# Altium schematic sheet AFE.SchDoc (part 3 of 3)
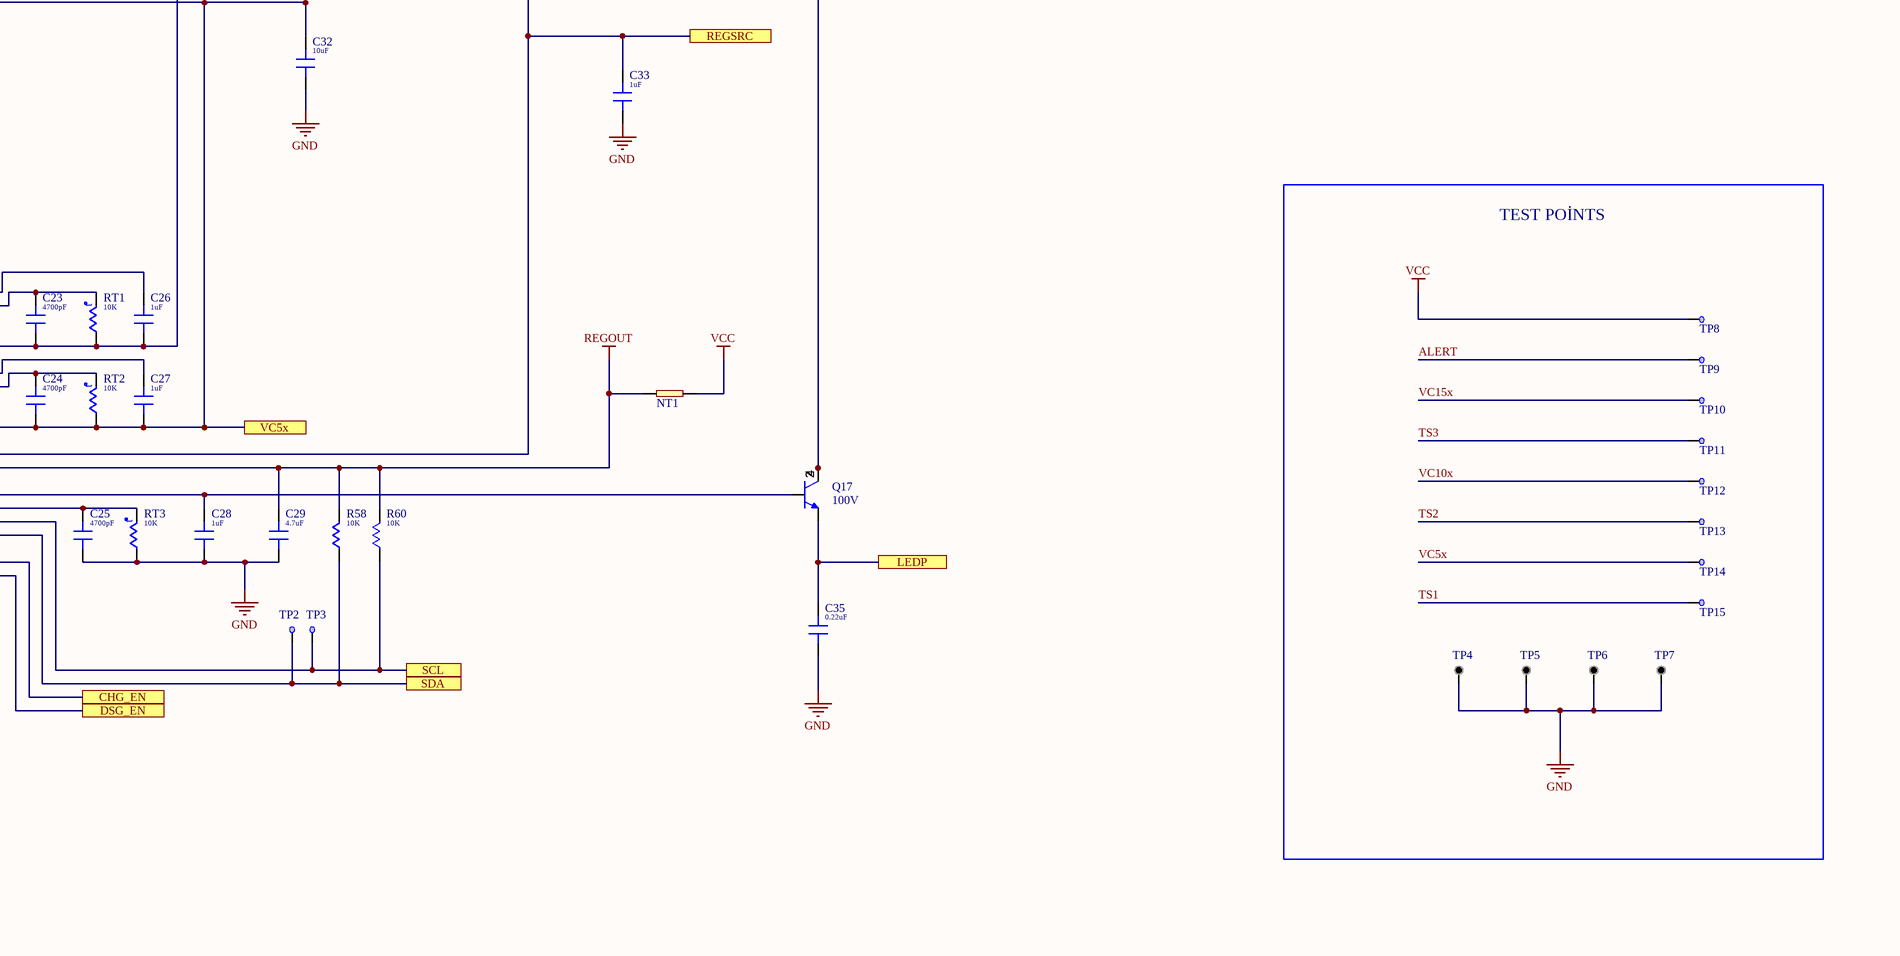
[diagram p5: AFE.SchDoc, bottom right]

## Library data of the parts (continued)
R65 R69 = R_10M_%1_1/10W_0603: SMD Chip Resistor, 10 MOhm, ± 1%, 100 mW, 0603 [1608 Metric], Thick Film, General Purpose; Manufacturer: Vishay; Power Rating: 100mW; Voltage Rating: 75V; Temperature Coefficient: 100ppm/°C; Supplier: Mouser; Supplier Part Number: 71-CRCW0603-10M-E3; Manufacturer Part Number: CRCW060310M0FKEA; RoHS: Yes; Category: Chip SMD Resistors; Stock: 48064; Pricing: 1=0,1, 10=0,017, 50=0,017, 100=0,01, 1000=0,007, 10000=0,003 (USD); Case/Package: 0603; Weight: 7.1E-05oz; Case Code (Imperial): 0603; Case Code (Metric): 1608; Contact Plating: Tin; Min Operating Temperature: -55°C; Max Operating Temperature: 155°C; Resistor Type: Thick Film; Tolerance: 1%; Packaging: Tape and Reel; Package Quantity: 5000; Termination: SMD/SMT; Working Voltage: 75V; Number of Terminations: 2; Features: Automotive AEC-Q200; Series: CRCW; Max Power Dissipation: 100mW; Resistance Tolerance: 1%; Technology: THICK FILM; Construction: Rectangular; Voltage Rating (DC): 75V; Length: 1.55mm; Width: 0.85mm; Height: 0.45mm; Depth: 0.85mm; Ratings: AEC-Q200; Radiation Hardening: No; Lead Free: 5697LeadFree; Military Standard: Not; RoHS Compliant: Yes; Reach SVHC Compliant: Unknown; ComponentLink1URL: https://datasheet.ciiva.com/11808/0900766b80d98afc-11808549.pdf?src-supplier=Rs; ComponentLink1Description: https://datasheet.ciiva.com/11808/0900766b80d98afc-11808549.pdf?src-supplier=Rs; ComponentLink2URL: https://datasheet.ciiva.com/7673/1720486-7673454.pdf?src-supplier=Element14; ComponentLink2Description: https://datasheet.ciiva.com/7673/1720486-7673454.pdf?src-supplier=Element14; ComponentLink3URL: https://datasheet.ciiva.com/26314/fld-crcw-e3-data-en-26314629.pdf?src-supplier=Distrelec; ComponentLink3Description: https://datasheet.ciiva.com/26314/fld-crcw-e3-data-en-26314629.pdf?src-supplier=Distrelec; ComponentLink4URL: https://datasheet.ciiva.com/7673/1697337-7673286.pdf?src-supplier=Element14; ComponentLink4Description: https://datasheet.ciiva.com/7673/1697337-7673286.pdf?src-supplier=Element14; ComponentLink5URL: https://datasheet.ciiva.com/16786/70201119-16786489.pdf?src-supplier=Allied+Electronics; ComponentLink5Description: https://datasheet.ciiva.com/16786/70201119-16786489.pdf?src-supplier=Allied+Electronics; ComponentLink6URL: https://datasheet.ciiva.com/5543/dcrcwe3-109170-5543450.pdf?src-supplier=Mouser; ComponentLink6Description: https://datasheet.ciiva.com/5543/dcrcwe3-109170-5543450.pdf?src-supplier=Mouser; ComponentLink7URL: https://datasheet.ciiva.com/3256/dcrcwe3-3256952.pdf?src-supplier=Avnet; ComponentLink7Description: https://datasheet.ciiva.com/3256/dcrcwe3-3256952.pdf?src-supplier=Avnet; ComponentLink8URL: https://datasheet.ciiva.com/16200/dcrcwe3-16200110.pdf?src-supplier=Future+Electronics; ComponentLink8Description: https://datasheet.ciiva.com/16200/dcrcwe3-16200110.pdf?src-supplier=Future+Electronics
R70 = R_1M_%5_1/10W_0603: SMD Chip Resistor, 1 MOhm, ± 5%, 100 mW, 0603 [1608 Metric], Thick Film, General Purpose; Manufacturer: Vishay Dale; Temperature Coefficient: 200ppm/°C; Power Rating: 100mW; Voltage Rating: 75V; Supplier: Mouser; Supplier Part Number: 71-CRCW0603J-1.0M-E3; Manufacturer Part Number: CRCW06031M00JNEA; RoHS: Yes; Category: Chip SMD Resistors; Stock: 24009; Pricing: 1=0,1, 10=0,014, 50=0,014, 100=0,009, 1000=0,007, 10000=0,003 (USD); Case/Package: 0603; Pins: 2; Contact Plating: Tin; Weight: 7.1E-05oz; Case Code (Imperial): 0603; Case Code (Metric): 1608; Min Operating Temperature: -55°C; Max Operating Temperature: 155°C; Tolerance: 5%; Packaging: Tape and Reel; Package Quantity: 5000; Termination: SMD/SMT; Resistor Type: Thick Film; Number of Terminations: 2; Max Power Dissipation: 100mW; Features: Automotive AEC-Q200; Series: CRCW; Construction: Rectangular; Resistance Tolerance: 5%; Length: 1.55mm; Width: 0.85mm; Height: 0.45mm; Depth: 0.85mm; Ratings: AEC-Q200; Radiation Hardening: No; RoHS Compliant: Yes; Lead Free: 5697LeadFree; Military Standard: Not; Reach SVHC Compliant: Unknown; ComponentLink1URL: https://datasheet.ciiva.com/2462/dcrcwe3-2462062.pdf?src-supplier=Digikey; ComponentLink1Description: https://datasheet.ciiva.com/2462/dcrcwe3-2462062.pdf?src-supplier=Digikey; ComponentLink2URL: https://datasheet.ciiva.com/2462/dcrcwe3-2462063.pdf?src-supplier=Digikey; ComponentLink2Description: https://datasheet.ciiva.com/2462/dcrcwe3-2462063.pdf?src-supplier=Digikey; ComponentLink3URL: https://datasheet.ciiva.com/2462/dcrcwe3-2462061.pdf?src-supplier=Digikey; ComponentLink3Description: https://datasheet.ciiva.com/2462/dcrcwe3-2462061.pdf?src-supplier=Digikey; ComponentLink4URL: https://datasheet.ciiva.com/5546/dcrcwe3-109170-5546629.pdf?src-supplier=Mouser; ComponentLink4Description: https://datasheet.ciiva.com/5546/dcrcwe3-109170-5546629.pdf?src-supplier=Mouser; ComponentLink5URL: https://datasheet.ciiva.com/3257/dcrcwe3-3257206.pdf?src-supplier=Avnet; ComponentLink5Description: https://datasheet.ciiva.com/3257/dcrcwe3-3257206.pdf?src-supplier=Avnet; ComponentLink6URL: https://datasheet.ciiva.com/16351/dcrcwe3-16351110.pdf?src-supplier=Future+Electronics; ComponentLink6Description: https://datasheet.ciiva.com/16351/dcrcwe3-16351110.pdf?src-supplier=Future+Electronics; ComponentLink7URL: https://datasheet.ciiva.com/3257/dcrcwe3-3257205.pdf?src-supplier=Avnet; ComponentLink7Description: https://datasheet.ciiva.com/3257/dcrcwe3-3257205.pdf?src-supplier=Avnet
RT1-RT3 = NTC_TERMISTOR_10K_%1: Thermistor NTC 10KOhm 1% 2-Pin; Manufacturer: Semitec; Supplier: Mouser; Supplier Part Number: 954-103AT-2; Manufacturer Part Number: 103AT-2; RoHS: Yes; Category: Thermistors; Stock: 31131; Pricing: 1=0,84, 10=0,64, 50=0,64, 100=0,453, 1000=0,344, 10000=0,282 (USD); Case/Package: 72Case; Pins: 2; Min Operating Temperature: -50°C; Max Operating Temperature: 110°C; Packaging: Bulk; Tolerance: 1%; Termination: Radial; Series: AT; Length: 17mm; Width: 3.7mm; Height: 2.4mm; Lead Pitch: 2.54mm; RoHS Compliant: Yes; ComponentLink1URL: https://datasheet.ciiva.com/4505/semitec-atthermistor-371460-4505142.pdf?src-supplier=Mouser; ComponentLink1Description: https://datasheet.ciiva.com/4505/semitec-atthermistor-371460-4505142.pdf?src-supplier=Mouser
TP1 = TP_CONN_2POS_2.54MM: Conn Unshrouded Header HDR 2 POS 2.54mm Solder ST Top Entry Thru-Hole; Manufacturer: Sullins; Gender: 29Gender; Number of Contacts: 2NUMBER; Current Rating: 3A; Supplier: Future Electronics; Supplier Part Number: 7889157; Manufacturer Part Number: PEC02SAAN; RoHS: Yes; Category: Headers and Wire Housings; Stock: 4156; Pricing: 1=0,103, 400=0,0989, 1250=0,0947, 4000=0,0906, 12500=0,0829 (USD); Housing Color: 46Colour; Contact Material: 150,153,154ConductorMaterial; Housing Material: 4239ConductorMaterial; Min Operating Temperature: -65°C; Max Operating Temperature: 125°C; Length: 5.08mm; Width: 2.54mm; Height: 2.54mm; Lead Free: 5697LeadFree; ComponentLink1URL: https://datasheet.ciiva.com/16213/pec02saan-16213358.pdf?src-supplier=Future+Electronics; ComponentLink1Description: https://datasheet.ciiva.com/16213/pec02saan-16213358.pdf?src-supplier=Future+Electronics
TP2 TP3 TP8-TP15 = TP_PC_TEST_POİNT: TEST POINT, PCB, THROUGH HOLE; Product R; Range: -; Connector Colour: Black; Mounting: Through Hole; Manufacturer: Keystone Electronics; Gender: 30Gender; Inside Diameter: 1.78mm; Supplier: Future Electronics; Supplier Part Number: 5322706; Manufacturer Part Number: 5011; RoHS: Yes; Category: Connectors; Stock: 212621; Pricing: 1=0,169, 200=0,164, 500=0,159, 1250=0,154, 3000=0,144 (USD); Length: 11.3mm; Lead Free: 5697LeadFree; ComponentLink1URL: https://datasheet.ciiva.com/11744/0900766b8009b7c7-11744935.pdf?src-supplier=Rs; ComponentLink1Description: https://datasheet.ciiva.com/11744/0900766b8009b7c7-11744935.pdf?src-supplier=Rs; ComponentLink2URL: https://datasheet.ciiva.com/1454/1718230-1454834.pdf?src-supplier=Element14; ComponentLink2Description: https://datasheet.ciiva.com/1454/1718230-1454834.pdf?src-supplier=Element14; ComponentLink3URL: https://datasheet.ciiva.com/46412/1703983-46412138.pdf?src-supplier=Element14; ComponentLink3Description: https://datasheet.ciiva.com/46412/1703983-46412138.pdf?src-supplier=Element14; ComponentLink4URL: https://datasheet.ciiva.com/16351/m60-2p60-16351093.pdf?src-supplier=Future+Electronics; ComponentLink4Description: https://datasheet.ciiva.com/16351/m60-2p60-16351093.pdf?src-supplier=Future+Electronics; ComponentLink5URL: https://datasheet.ciiva.com/2917/5011-2917635.pdf?src-supplier=Digikey; ComponentLink5Description: https://datasheet.ciiva.com/2917/5011-2917635.pdf?src-supplier=Digikey
TP4-TP7 = TP_GND
U1 = AFE_IC_44TSSOP: 9 to 15-series cell li-ion and li-phosphate battery monitor (bq76940 family) 44-TSSOP -40 to 85; Manufacturer: Texas Instruments; Supplier: Digikey; Supplier Part Number: 296-BQ7694000DBTRCT-ND; Manufacturer Part Number: BQ7694000DBTR; RoHS: Yes; Category: Battery Management; Stock: 2000; Pricing: 1=5,92, 10=5,317, 25=5,0268, 100=4,3565, 250=4,13312, 500=3,70864, 1000=3,12777 (USD); ComponentLink1URL: http://www.ti.com/lit/gpn/bq76940?src-supplier=Mouser; ComponentLink1Description: http://www.ti.com/lit/gpn/bq76940?src-supplier=Mouser; ComponentLink2URL: http://www.ti.com/general/docs/suppproductinfo.tsp?distId=10&amp;gotoUrl=http%3A%2F%2Fwww.ti.com%2Flit%2Fgpn%2Fbq76920&src-supplier=Digikey; ComponentLink2Description: http://www.ti.com/general/docs/suppproductinfo.tsp?distId=10&amp;gotoUrl=http%3A%2F%2Fwww.ti.com%2Flit%2Fgpn%2Fbq76920&src-supplier=Digikey; ComponentLink3URL: http://www.ti.com/general/docs/lit/getliterature.tsp?genericPartNumber=BQ76920&&fileType=pdf&src-supplier=Avnet; ComponentLink3Description: http://www.ti.com/general/docs/lit/getliterature.tsp?genericPartNumber=BQ76920&&fileType=pdf&src-supplier=Avnet